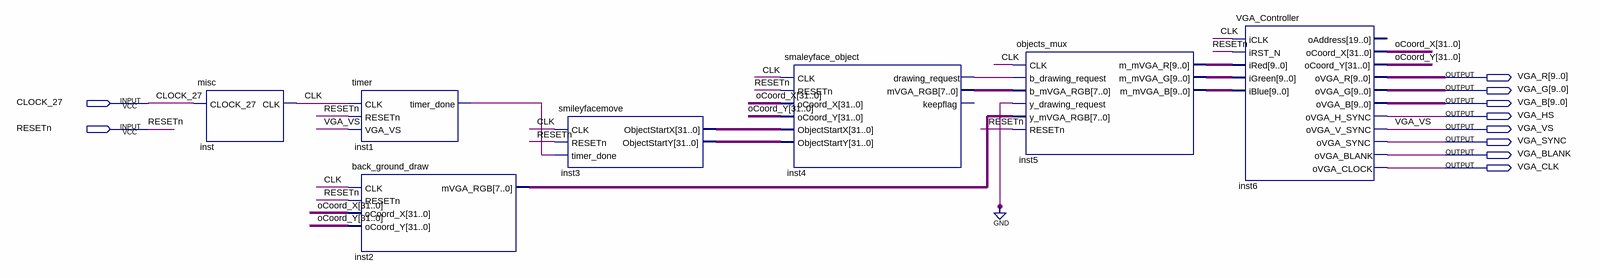
[diagram p0: schematic sheet]
// Quartus schematic TOP_SIFTACH.bdf as structural Verilog: 7 symbols, 10 pins
module TOP_SIFTACH (
  input  CLOCK_27,
  input  RESETn,
  output [9:0] VGA_R,
  output [9:0] VGA_G,
  output [9:0] VGA_B,
  output VGA_HS,
  output VGA_VS,
  output VGA_SYNC,
  output VGA_BLANK,
  output VGA_CLK
);

  wire CLK, inst1_timer_done, inst4_drawing_request;
  wire [7:0] inst2_mvga_rgb, inst4_mvga_rgb;
  wire [9:0] inst5_m_mvga_b, inst5_m_mvga_g, inst5_m_mvga_r;
  wire [31:0] inst3_objectstartx, inst3_objectstarty, oCoord_X, oCoord_Y;

  misc inst (.CLOCK_27(CLOCK_27), .CLK(CLK));
  timer inst1 (.CLK(CLK), .RESETn(RESETn), .VGA_VS(VGA_VS), .timer_done(inst1_timer_done));
  back_ground_draw inst2 (
    .CLK(CLK), .RESETn(RESETn), .oCoord_X(oCoord_X), .oCoord_Y(oCoord_Y), .mVGA_RGB(inst2_mvga_rgb));
  smileyfacemove inst3 (
    .CLK(CLK), .RESETn(RESETn), .timer_done(inst1_timer_done), .ObjectStartX(inst3_objectstartx),
    .ObjectStartY(inst3_objectstarty));
  smaleyface_object inst4 (
    .CLK(CLK), .RESETn(RESETn), .oCoord_X(oCoord_X), .oCoord_Y(oCoord_Y), .ObjectStartX(inst3_objectstartx),
    .ObjectStartY(inst3_objectstarty), .drawing_request(inst4_drawing_request), .mVGA_RGB(inst4_mvga_rgb));  // open: keepflag
  objects_mux inst5 (
    .CLK(CLK), .b_drawing_request(inst4_drawing_request), .b_mVGA_RGB(inst4_mvga_rgb),
    .y_drawing_request(1'b0), .y_mVGA_RGB(inst2_mvga_rgb), .RESETn(RESETn), .m_mVGA_R(inst5_m_mvga_r),
    .m_mVGA_G(inst5_m_mvga_g), .m_mVGA_B(inst5_m_mvga_b));
  VGA_Controller inst6 (
    .iCLK(CLK), .iRST_N(RESETn), .iRed(inst5_m_mvga_r), .iGreen(inst5_m_mvga_g), .iBlue(inst5_m_mvga_b),
    .oCoord_X(oCoord_X), .oCoord_Y(oCoord_Y), .oVGA_R(VGA_R), .oVGA_G(VGA_G), .oVGA_B(VGA_B),
    .oVGA_H_SYNC(VGA_HS), .oVGA_V_SYNC(VGA_VS), .oVGA_SYNC(VGA_SYNC), .oVGA_BLANK(VGA_BLANK),
    .oVGA_CLOCK(VGA_CLK));  // open: oAddress
endmodule
